# Altium schematic sheet ESP32-S3_Amplifier_and_IMU.SchDoc
size A4; SheetNumber: 2; SheetTotal: 2
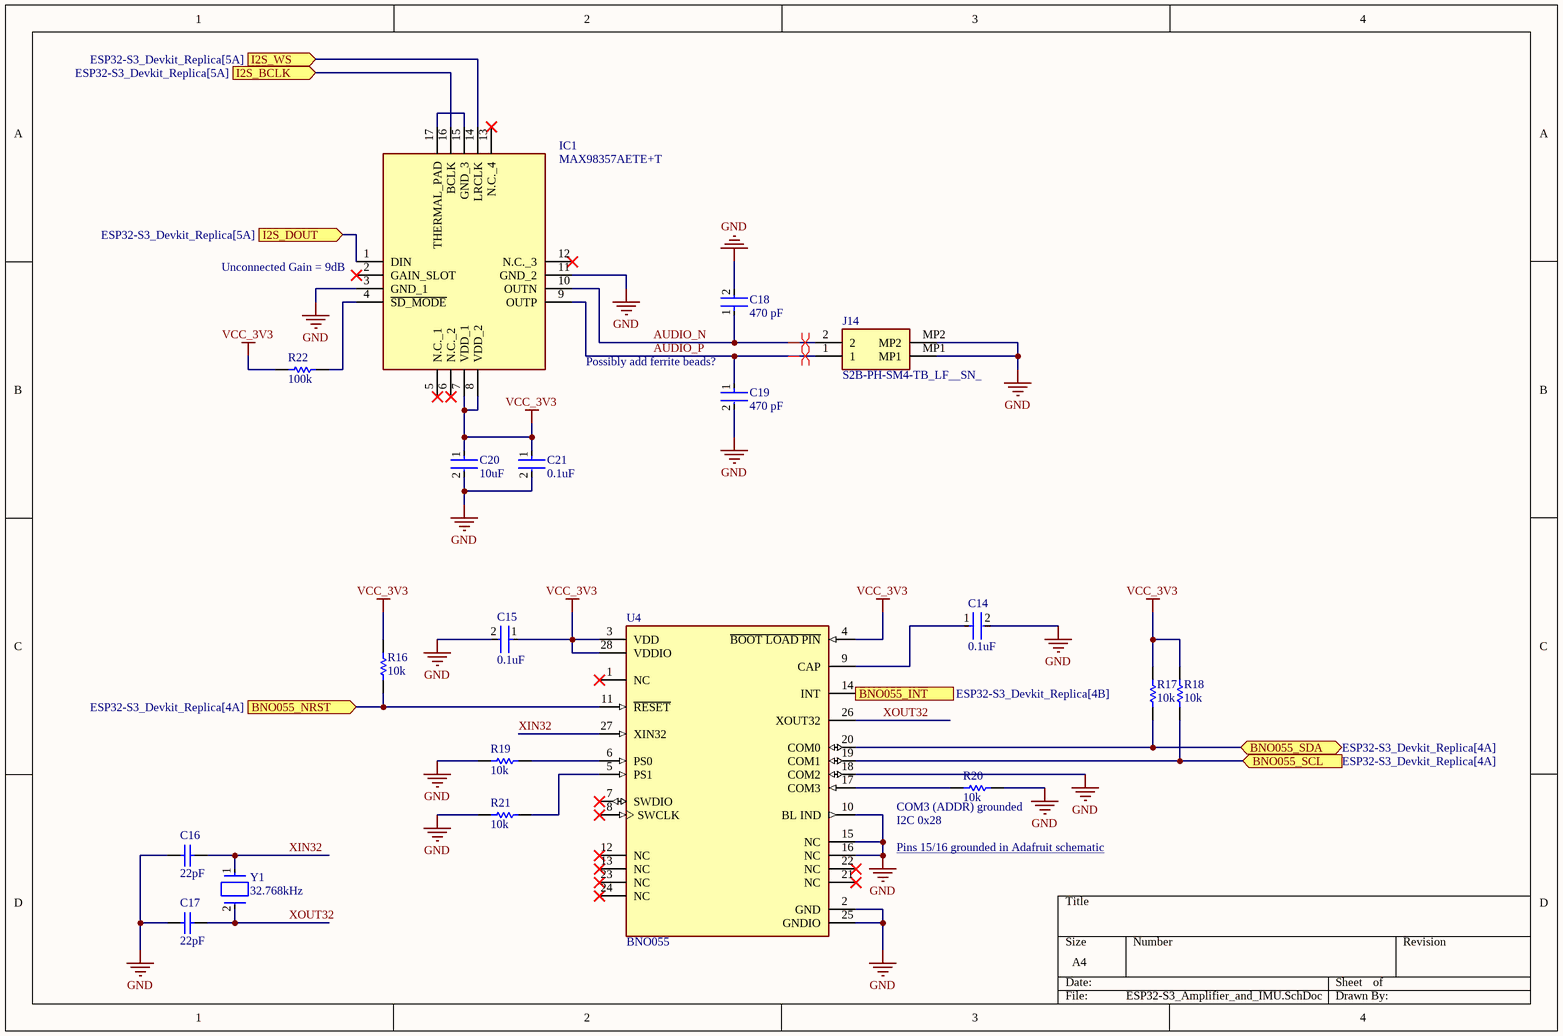
[diagram p0: ESP32-S3_Amplifier_and_IMU.SchDoc]

## Parts
C14  Capacitance: 0.1uF  [FP-C1005-050-0_05-IPC_C]  (hidden comment: C1005X7R1H104K050BB)
C15  Capacitance: 0.1uF  [FP-C1005-050-0_05-IPC_C]  (hidden comment: C1005X7R1H104K050BB)
C16  Capacitance: 22pF  [CAPC1005X55X25ML05T05]  (hidden comment: CC0402JRNPO9BN220)
C17  Capacitance: 22pF  [CAPC1005X55X25ML05T05]  (hidden comment: CC0402JRNPO9BN220)
C18  Capacitance: 470 pF  [FP-C0402-BB-MFG]  (hidden comment: C0402C471J5GACAUTO)
C19  Capacitance: 470 pF  [FP-C0402-BB-MFG]  (hidden comment: C0402C471J5GACAUTO)
C20  Capacitance: 10uF  [FP-GRM21B-0_2-e0_2_0_7-IPC_B]  (hidden comment: GRM21BC8YA106KE11L)
C21  Capacitance: 0.1uF  [FP-C1005-050-0_05-IPC_C]  (hidden comment: C1005X7R1H104K050BB)
IC1  MAX98357AETE+T  [QFN50P300X300X80-17N]
J14  S2B-PH-SM4-TB_LF__SN_  [S2BPHSM4TBLFSN]
R16  Resistance: 10k  [RESC1005X40X25ML05T10]  (hidden comment: CRCW040210K0FKEDHP)
R17  Resistance: 10k  [RESC1005X40X25ML05T10]  (hidden comment: CRCW040210K0FKEDHP)
R18  Resistance: 10k  [RESC1005X40X25ML05T10]  (hidden comment: CRCW040210K0FKEDHP)
R19  Resistance: 10k  [RESC1005X40X25ML05T10]  (hidden comment: CRCW040210K0FKEDHP)
R20  Resistance: 10k  [RESC1005X40X25ML05T10]  (hidden comment: CRCW040210K0FKEDHP)
R21  Resistance: 10k  [RESC1005X40X25ML05T10]  (hidden comment: CRCW040210K0FKEDHP)
R22  Resistance: 100k  [RESC1005X40X25NL05T10]  (hidden comment: RC0402FR-07100KL)
U4  BNO055  [FP-BNO055-MFG]
Y1  Frequency: 32.768kHz  [FP-ABS07-MFG]  (hidden comment: ABS07-32.768KHZ-T)

## Ports
BNO055_INT (out, see ESP32-S3_Devkit_Replica[4B]), BNO055_NRST (in, see ESP32-S3_Devkit_Replica[4A]), BNO055_SCL (in, see ESP32-S3_Devkit_Replica[4A]), BNO055_SDA (bidir, see ESP32-S3_Devkit_Replica[4A]), I2S_BCLK (in, see ESP32-S3_Devkit_Replica[5A]), I2S_DOUT (in, see ESP32-S3_Devkit_Replica[5A]), I2S_WS (in, see ESP32-S3_Devkit_Replica[5A])

## Nets
GND: C14.2 C15.2 C16.2 C17.2 C18.2 C19.2 C20.2 C21.2 IC1.3(GND_1) IC1.11(GND_2) J14.MP1 J14.MP2 R19.1 R20.2 R21.1 U4.2(GND) U4.10(BL_IND) U4.15(NC) U4.16(NC) U4.18(COM2) U4.25(GNDIO)
VCC_3V3: C15.1 C20.1 C21.1 IC1.7(VDD_1) IC1.8(VDD_2) R16.2 R17.2 R18.2 R22.2 U4.3(VDD) U4.4(~{BOOT_LOAD_PIN}) U4.28(VDDIO)
AUDIO_N: C18.1 IC1.10(OUTN) J14.2
AUDIO_P: C19.1 IC1.9(OUTP) J14.1
BNO055_INT: U4.14(INT) ; port BNO055_INT
BNO055_NRST: R16.1 U4.11(~{RESET}) ; port BNO055_NRST
BNO055_SCL: R18.1 U4.19(COM1) ; port BNO055_SCL
BNO055_SDA: R17.1 U4.20(COM0) ; port BNO055_SDA
I2S_BCLK: IC1.16(BCLK) ; port I2S_BCLK
I2S_DOUT: IC1.1(DIN) ; port I2S_DOUT
I2S_WS: IC1.14(LRCLK) ; port I2S_WS
XIN32: C16.1 U4.27(XIN32) Y1.1
XOUT32: C17.1 U4.26(XOUT32) Y1.2
NetC14_1: C14.1 U4.9(CAP)
NetIC1_4: IC1.4(~{SD_MODE}) R22.1
NetIC1_15: IC1.15(GND_3) IC1.17(THERMAL_PAD)
NetR19_2: R19.2 U4.6(PS0)
NetR20_1: R20.1 U4.17(COM3)
NetR21_2: R21.2 U4.5(PS1)

Not connected (* = marked no-connect by the designer): IC1 2(GAIN_SLOT)* 5(N.C._1)* 6(N.C._2)* 12(N.C._3)* 13(N.C._4)*; U4 1(NC)* 7(SWDIO)* 8(SWCLK)* 12(NC)* 13(NC)* 21(NC)* 22(NC)* 23(NC)* 24(NC)*

## Layout directives
differential pair: AUDIO_N, AUDIO_P

## Notes on the sheet
- (near IC1) Unconnected Gain = 9dB
- (near C19) Possibly add ferrite beads?
- Pins 15/16 grounded in Adafruit schematic <https://cdn-learn.adafruit.com/assets/assets/000/024/546/original/sensors_BNO055_REV-C.png>
- (near R20) COM3 (ADDR) grounded
- (near R20) I2C 0x28

## Library data of the parts
C14 C15 C21 = CMP-2000-05393-2: Multilayer Ceramic Capacitors 100nF ±10% 50V X7R SMD 0402; Voltage: 50V; Dielectric Material: Ceramic; Min Operating Temperature: -55°C; Depth: 0.5mm; Radiation Hardening: No; RoHS Compliant: Yes; Voltage Rating (DC): 50V; Lead Free: Lead Free; Resistor Type: Ceramic; Height: 0.5mm; Dielectric: X7R; Thickness: 0.022inch; Case/Package: 0402; Case Code (Metric): 1005; Termination: SMD/SMT; Packaging: Tape and Reel; Max Operating Temperature: 125°C; Mount: Surface Mount; Package Quantity: 1; Width: 0.02inch; Weight: 2.3E-05oz; Voltage Rating: 50V; Tolerance: 10%; Construction: Flat; Case Code (Imperial): 0402; Length: 1mm; REACH SVHC: No SVHC; Series: C
C16 C17 = CMP-2100-03590-1: Chip Capacitor, 22 pF, +/- 5%, 50 V, -55 to 125 degC, 0402 (1005 Metric), RoHS, Tape and Reel; Manufacturer: Yageo; Voltage Rating: 50V; Dielectric Material: Ceramic; Temperature Coefficient: 30ppm/degC; Dielectric: C0G; Insulation Resistance: 100GR; Datasheet URL: http://www.yageo.com/NewPortal/yageodocoutput?fileName=/pdf/MLCC/UPY-GP_NP0_16V-to-50V_14.pdf; Depth: 0.5mm; Number of Pins: 2; Height: 0.5mm; Min Operating Temperature: -55degC; REACH SVHC: NoSVHC; Max Operating Temperature: 125degC; Voltage Rating (DC): 50V; Composition: Ceramic; Packaging: TapeandReel; Package Quantity: 1; Package Reference: 0402; Length: 1mm; Radiation Hardening: No; Package Description: 2-Pin Surface Mount Device, Body 1 x 0.5 mm; RoHSCompliant: True; Thickness: 0.022inch; Manufacturer URL: http://www.yageo.com/; Mount: SurfaceMount; Case Code (Metric): 1005; Case/Package: 0402; Tolerance: 5%; Termination: SMD/SMT; Width: 0.02inch; Datasheet Version: Rev. 14, 07/2016; Lead Free: LeadFree; Case Code (Imperial): 0402
C18 C19 = CMP-03020-004540-2: CAP CER 470PF 50V C0G/NP0 0402; Manufacturer: Kemet; Material: Ceramic; Tolerance: 0.05; Temperature Coefficient: 15%; Temperature Characteristic: C0G; Ipc Land Pattern Name: CAPC10050X50; Package: C0402-BB; Temperature Range Low: -55°C; ComponentLink2URL: https://content.kemet.com/datasheets/KEM_C1002_X7R_SMD.pdf; Category: Cap; Lead Free: Yes; Voltage Rating: 50 V; Automotive: No; Device Class L1: Passive Components; Temperature Range High: +125°C; Manufacturer Part Number: C0402C471J5GACAUTO; ComponentLink2Description: Datasheet; Device Class L3: Ceramic Capacitors; RoHS: TRUE; Height: 0.55mm; Octopart: https://octopart.com/c0402c471j5gacauto-kemet-34993933; Value: 470 pF; Device Class L2: Capacitors; Temperature: -55°C to +125°C; Digikey Description: CAP CER 470PF 50V C0G/NP0 0402
C20 = CMP-06035-021046-1: Chip Multilayer Ceramic Capacitors for General Purpose, 0805, 10uF, X6S, 22%, 10%, 35V; Case/Package: 0805; Case Code (Metric): 2012; Case Code (Imperial): 0805; Voltage Rating (DC): 35V; Tolerance: 10%; Thickness: 0.057inch; Dielectric: X6S; Package Quantity: 3000; Weight: 0.000335oz; Termination: SMD/SMT; Max Operating Temperature: 105°C; Voltage Rating: 35V; Packaging: Tape and Reel; Width: 1.25mm; Mount: Surface Mount; Min Operating Temperature: -55°C; Length: 0.079inch; Height: 1.25mm; REACH SVHC: No SVHC; Lead Free: Lead Free
IC1 = MAX98357AETE+T: Integrated Circuit; Manufacturer_Name: Analog Devices; Datasheet Link: https://datasheets.maximintegrated.com/en/ds/MAX98357A-MAX98357B.pdf; Height: 0.8mm; Manufacturer_Part_Number: MAX98357AETE+T; Mouser Part Number: 700-MAX98357AETE+T; Mouser Price/Stock: https://www.mouser.co.uk/ProductDetail/Analog-Devices-Maxim-Integrated/MAX98357AETE%2bT?qs=AAveGqk956HhNpoJjF5x2g%3D%3D; Arrow Part Number: MAX98357AETE+T; Arrow Price/Stock: https://www.arrow.com/en/products/max98357aetet/analog-devices.html?utm_currency=USD&region=asia
J14 = S2B-PH-SM4-TB_LF__SN_: Connector; Manufacturer_Name: JST (JAPAN SOLDERLESS TERMINALS); Manufacturer_Part_Number: S2B-PH-SM4-TB(LF)(SN); Datasheet Link: https://www.jst-mfg.com/product/pdf/eng/ePH.pdf; Height: 6.6mm; Mouser Part Number: N/A; Mouser Price/Stock: https://www.mouser.co.uk/ProductDetail/JST-Commercial/S2B-PH-SM4-TBLFSN?qs=QpmGXVUTftEA9IU90i0xlg%3D%3D; Arrow Part Number: S2B-PH-SM4-TB(LF)(SN); Arrow Price/Stock: https://www.arrow.com/en/products/s2b-ph-sm4-tb-lf-sn/jst-manufacturing?utm_currency=USD&region=europe
R16-R21 = CMP-2002-03043-1: 1; Manufacturer: Vishay Dale; Part Number: CRCW040210K0FKEDHP
R22 = CMP-2002-07343-1: Manufacturer: Yageo / Phycomp; Part Number: RC0402FR-07100KL
U4 = CMP-2000-05075-4: IMU ACCEL/GYRO/MAG I2C 28LGA; Sensor Type: Accelerometer; Packaging: Tape and Reel; Case/Package: LGA; Min Operating Temperature: -40°C; Mount: Surface Mount; Output Type: I2C; Lead Free: Lead Free; Max Operating Temperature: 85°C
Y1 = CMP-0447-00001-4: Crystal 32.768kHz ±20ppm (Tol) 12.5pF FUND 70kΩ 2-Pin CSMD T/R; ESR (Equivalent Series Resistance): 70kR; Radiation Hardening: No; Length: 3.2mm; Max Operating Temperature: 85°C; Number of Pins: 2; Series: ABS07; Min Operating Temperature: -40°C; Frequency Tolerance: 20ppm; Packaging: Tape and Reel; Height: 0.9mm; Width: 1.5mm; Depth: 1.5mm; Load Capacitance: 12.5pF; RoHS Compliant: Yes; Tolerance: 20ppm; Termination: SMD/SMT; Lead Free: Lead Free; Series Resistance: 70kR; REACH SVHC: No SVHC; Case/Package: CSMD; Operating Frequency: 32.768 kHz; Package Quantity: 3000